# EAGLE design H10R4 (EAGLE 9.6.1)

## Sheet 1 of 2
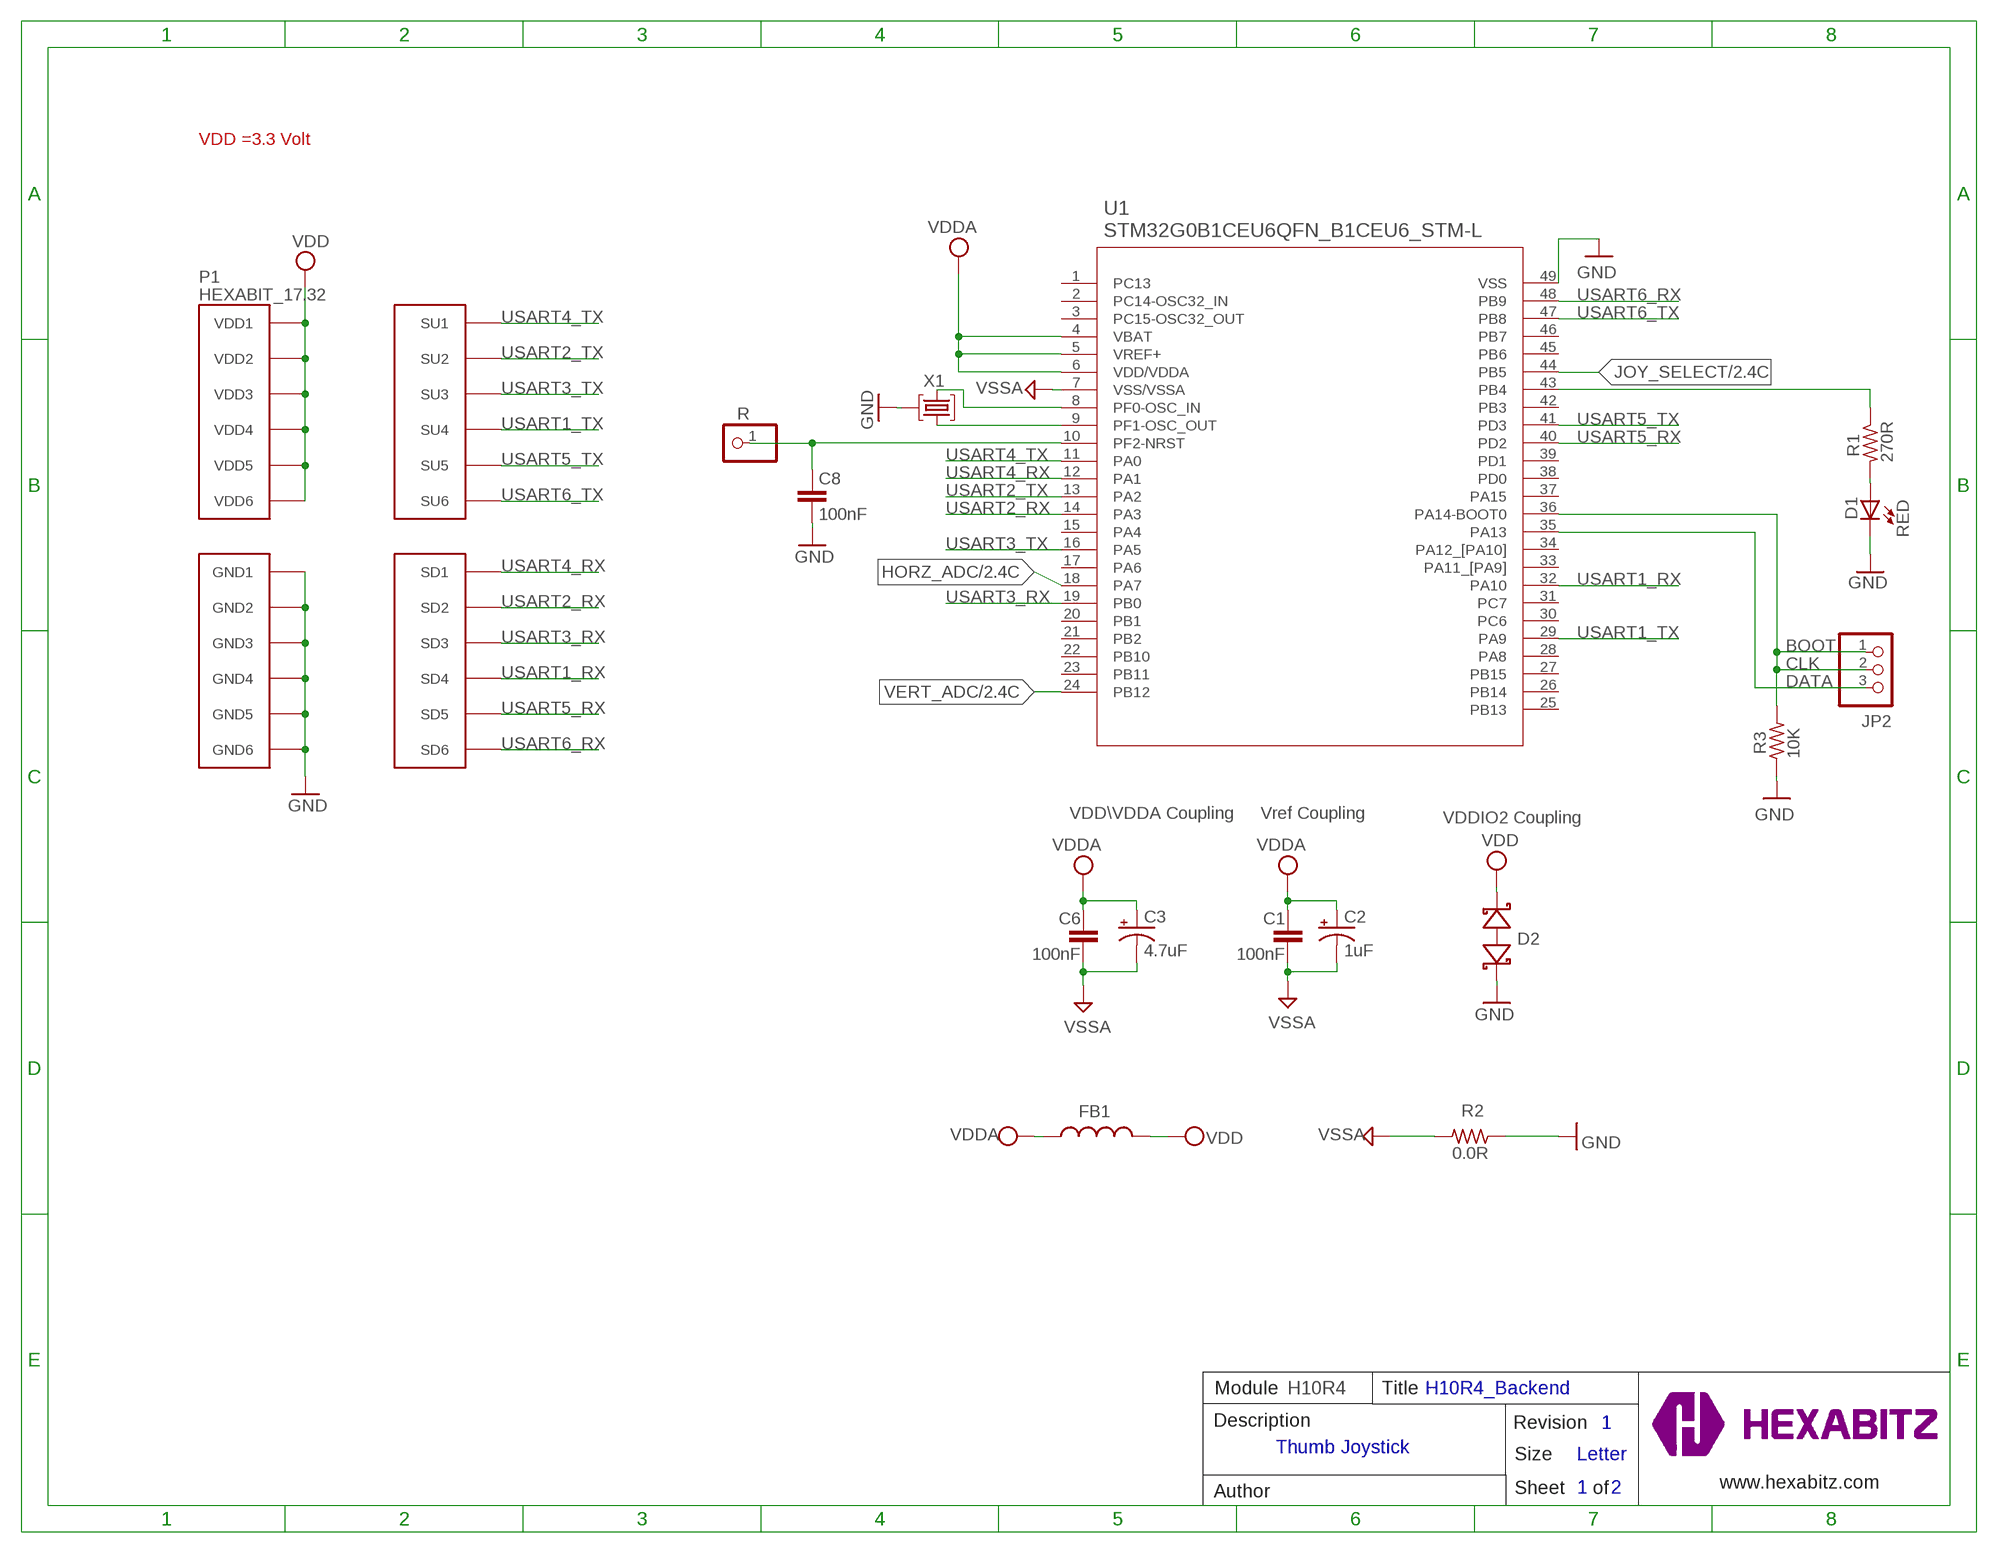
[diagram p0: schematic, sheet 1]

### Parts
C1  100nF  C-0603  [C-0603]
C2  1uF  C-0805-POL  [C-0805-POL]
C3  4.7uF  C-0805-POL  [C-0805-POL]
C6  100nF  C-0603  [C-0603]
C8  100nF  C-0603  [C-0603]
D1  RED  VLMS1300-GS08  [VLMS1300-GS08]
D2  BOURNS_CDSOD323-T03SCBOURNS_CDSOD323-T03SC_0_0  [BOURNS_CDSOD323-T03SC_0]
FB1  FB-TDK_MMZ1608Y300B  [FB-TDK_MMZ1608Y300B]
JP2  PINHD-1X3  [1X03]
P1  HEXABIT_17.32  [HEXABIT_17.32]
R  R  PINHD-1X1  [1X01]
R1  270R  R-0603  [R-0603]
R2  0.0R  R-0603  [R-0603]
R3  10K  R-0603  [R-0603]
TRIMBLE-LOGO1  HEXA-LOGO  [HEXA-LOGO]
U1  STM32G0B1CEU6QFN_B1CEU6_STM-L  [QFN_B1CEU6_STM-L]
X1  XTALL_CSTCE8M00G52  [XTALL_CSTCE8M00G52]

### Nets
CLK: JP2.1 JP2.2 R3.2 U1.36(PA14-BOOT0)
DATA: JP2.3 U1.35(PA13)
GND: C8.2 D1.C D2.1(A) P1.PAD_PD7(GND1) P1.PAD_PD8(GND2) P1.PAD_PD9(GND3) P1.PAD_PD10(GND4) P1.PAD_PD11(GND5) P1.PAD_PD12(GND6) R2.1 R3.1 U1.49(VSS) X1.P$2 ; also sheet 2
HORZ_ADC: U1.18(PA7) ; also sheet 2
JOY_SELECT: U1.44(PB5) ; also sheet 2
N$1: R1.1 U1.43(PB4)
N$3: D1.A R1.2
N$4: C8.1 R.1 U1.10(PF2-NRST)
N$5: U1.9(PF1-OSC_OUT) X1.P$1
N$6: U1.8(PF0-OSC_IN) X1.P$3
USART1_RX: P1.PAD_PD4(SD4) U1.32(PA10)
USART1_TX: P1.PAD_PU4(SU4) U1.29(PA9)
USART2_RX: P1.PAD_PD2(SD2) U1.14(PA3)
USART2_TX: P1.PAD_PU2(SU2) U1.13(PA2)
USART3_RX: P1.PAD_PD3(SD3) U1.19(PB0)
USART3_TX: P1.PAD_PU3(SU3) U1.16(PA5)
USART4_RX: P1.PAD_PD1(SD1) U1.12(PA1)
USART4_TX: P1.PAD_PU1(SU1) U1.11(PA0)
USART5_RX: P1.PAD_PD5(SD5) U1.40(PD2)
USART5_TX: P1.PAD_PU5(SU5) U1.41(PD3)
USART6_RX: P1.PAD_PD6(SD6) U1.48(PB9)
USART6_TX: P1.PAD_PU6(SU6) U1.47(PB8)
VDD: D2.2(C) FB1.2 P1.PAD_PU7(VDD1) P1.PAD_PU8(VDD2) P1.PAD_PU9(VDD3) P1.PAD_PU10(VDD4) P1.PAD_PU11(VDD5) P1.PAD_PU12(VDD6) ; also sheet 2
VDDA: C1.1 C2.1(+) C3.1(+) C6.1 FB1.1 U1.4(VBAT) U1.5(VREF+) U1.6(VDD/VDDA)
VERT_ADC: U1.24(PB12) ; also sheet 2
VSSA: C1.2 C2.2(-) C3.2(-) C6.2 R2.2 U1.7(VSS/VSSA)
Unconnected: U1.1(PC13) U1.2(PC14-OSC32_IN) U1.3(PC15-OSC32_OUT) U1.15(PA4) U1.17(PA6) U1.20(PB1) U1.21(PB2) U1.22(PB10) U1.23(PB11) U1.25(PB13) U1.26(PB14) U1.27(PB15) U1.28(PA8) U1.30(PC6) U1.31(PC7) U1.33(PA11_[PA9]) U1.34(PA12_[PA10]) U1.37(PA15) U1.38(PD0) U1.39(PD1) U1.42(PB3) U1.45(PB6) U1.46(PB7)

### Notes on the sheet
- VDD =3.3 Volt
- BOOT
- VDD\VDDA Coupling | Vref Coupling | VDDIO2 Coupling
- Module | H10R4 | Title | H10R4_Backend
- Description | Revision | 1
- Thumb Joystick
- Size | Letter
- 1 | 2 | www.hexabitz.com
- Author | Sheet     of
- C:/Users/Admin/Desktop/logodraft.bmp

## Sheet 2 of 2
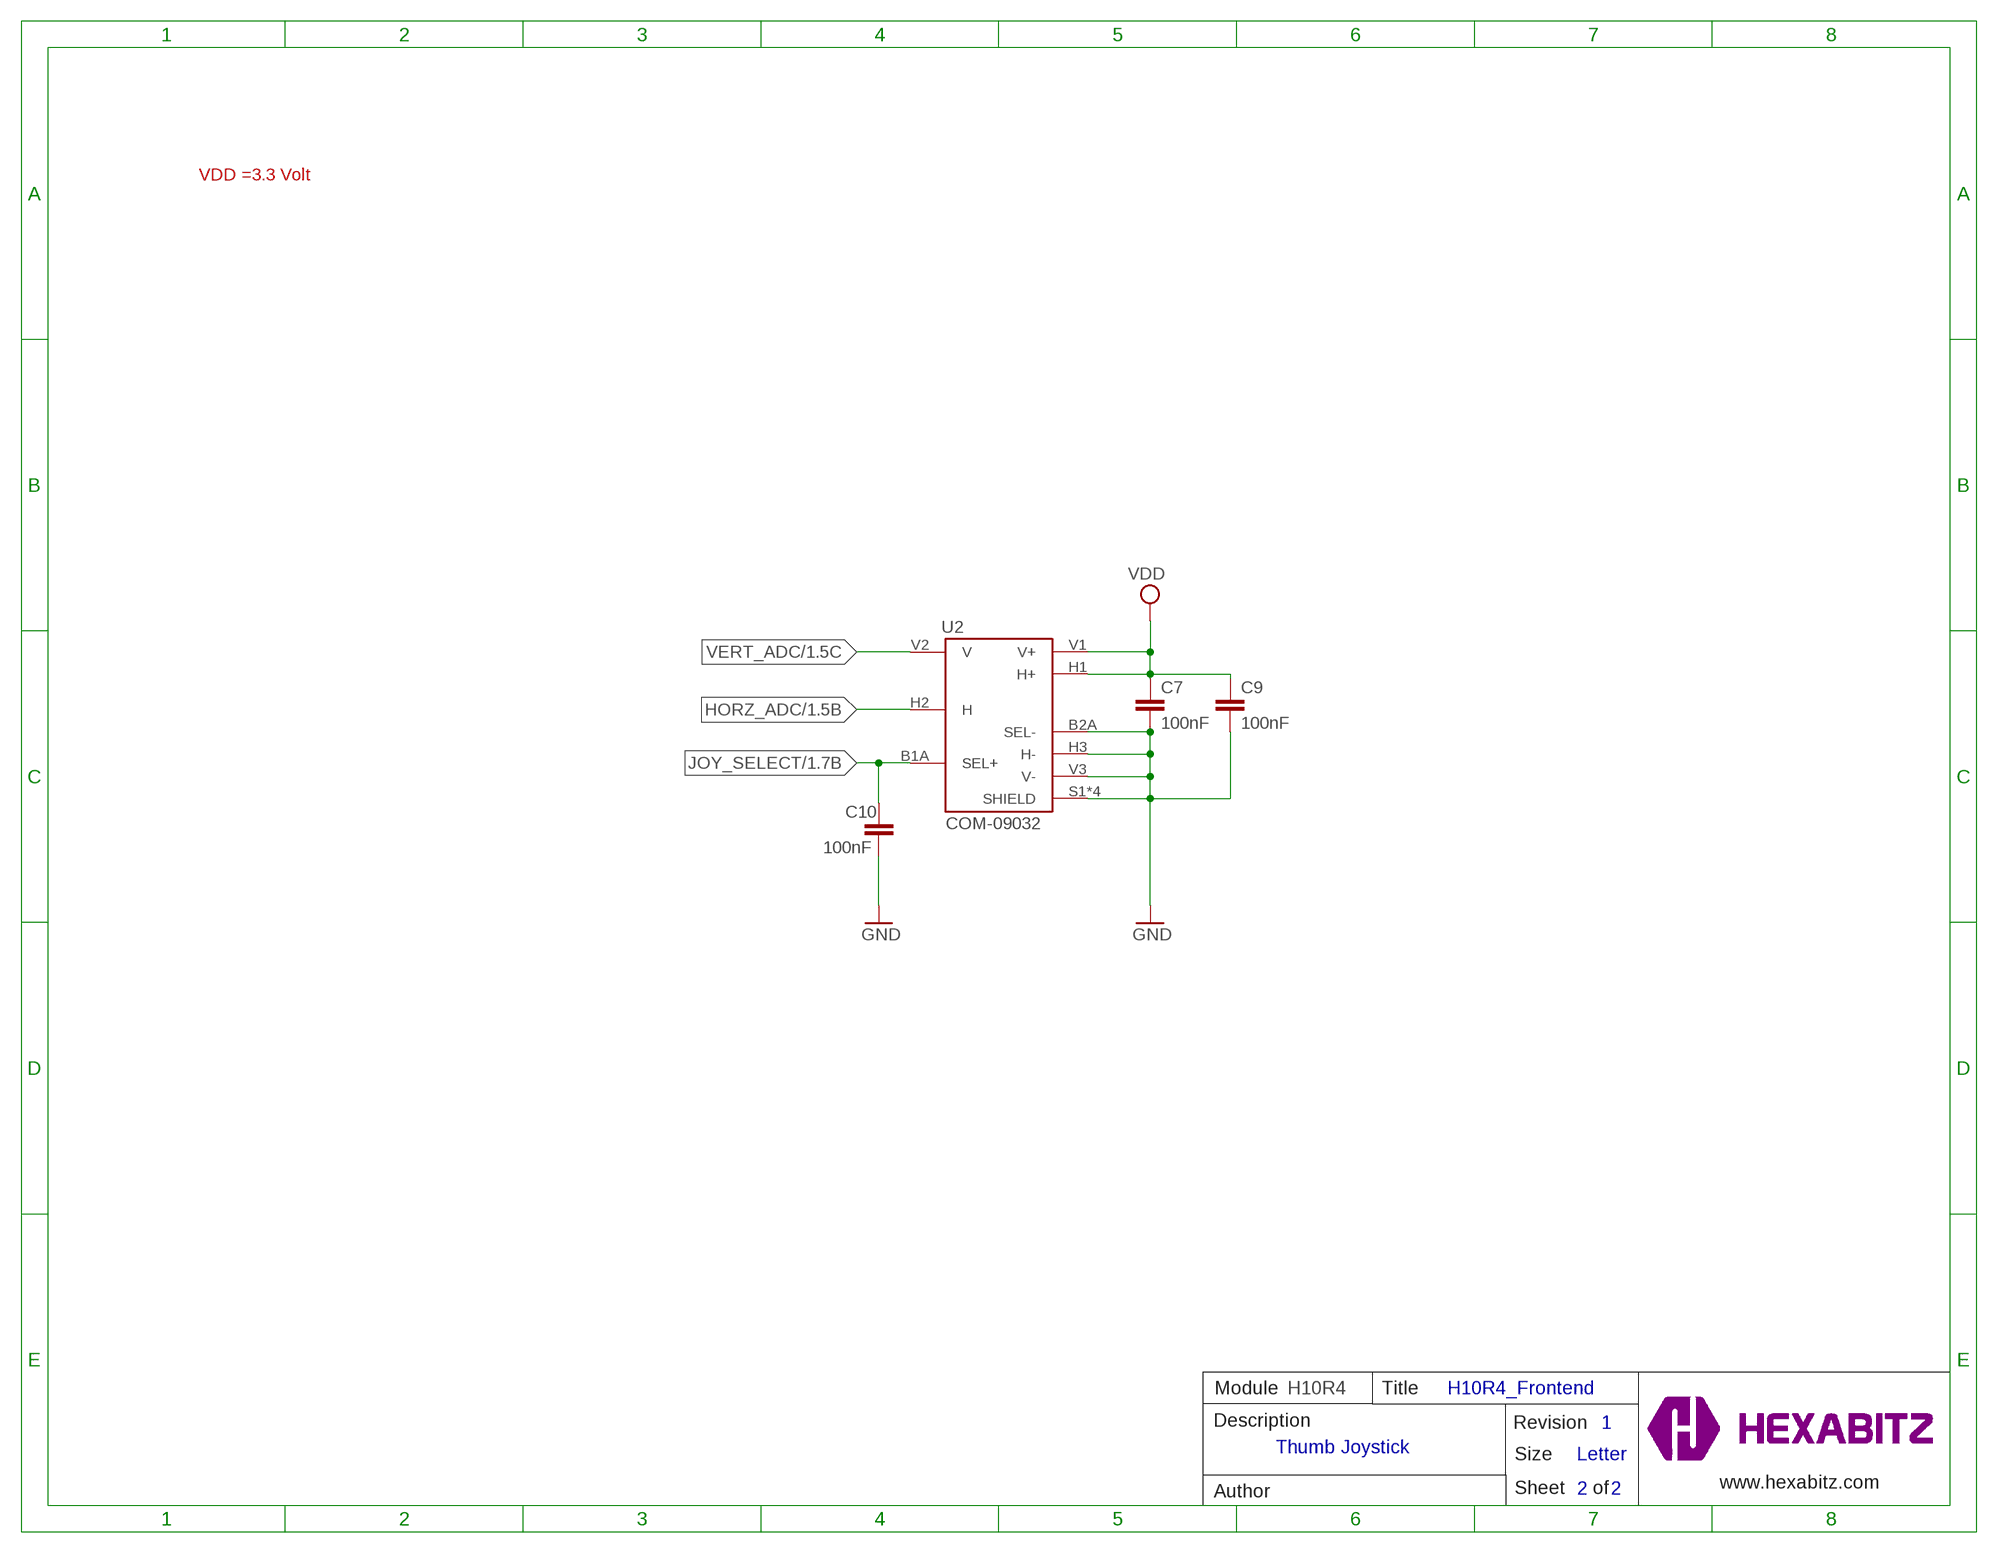
[diagram p1: schematic, sheet 2]

### Parts
C7  100nF  C-0603  [C-0603]
C9  100nF  C-0603  [C-0603]
C10  100nF  C-0603  [C-0603]
U2  COM-09032  [XDCR_COM-09032]

### Nets
GND: C7.2 C9.2 C10.2 U2.B2A(SEL-) U2.H3(H-) U2.S1(SHIELD) U2.S2(SHIELD) U2.S3(SHIELD) U2.S4(SHIELD) U2.V3(V-) ; also sheet 1
HORZ_ADC: U2.H2(H) ; also sheet 1
JOY_SELECT: C10.1 U2.B1A(SEL+) ; also sheet 1
VDD: C7.1 C9.1 U2.H1(H+) U2.V1(V+) ; also sheet 1
VERT_ADC: U2.V2(V) ; also sheet 1

### Notes on the sheet
- VDD =3.3 Volt
- Module | H10R4 | Title | H10R4_Frontend
- Description | Revision | 1
- Thumb Joystick
- Size | Letter
- www.hexabitz.com
- Author | Sheet     of | 2 | 2
- C:/Users/Admin/Desktop/logodraft.bmp

## Library data of the parts
C1 C6 C8 C9 = HEXABITZ_RCLS:C-0603: CAP CER 10% X7R 0603
C2 C3 = HEXABITZ_RCLS:C-0805-POL: Cap Tant Solid SMD 2012
C7 C10 = HEXABITZ_RCLS:C-0603: CAP CER 10% X7R 0603; CAPACITANCE: 100nF; MFN: KEMET; MPN: C0603C104K8RACTU; OCTOPART_URL: https://octopart.com/c0603c104k8ractu-kemet-145075?r=sp&s=9bS9ASSwSEqMCE9KBEQZ0g; TOLERANCE: 10%; VOLTAGE_RATING: 10V
D1 = Hexabitz:VLMS1300-GS08: Red 0603 130° Clear 54 mcd 2 V Surface Mount ChipLED ; Octopart Url : http://octopart.com/vlms1300-gs08-vishay-21709201; MFN: Vishay; MPN: VLMS1300-GS08; OCTOPART_URL: https://octopart.com/vlms1300-gs08-vishay-21709201?r=sp&s=_gcP4_q8T1SC6PJQPTQ9yA
D2 = HEXABITZ_RCLS:BOURNS_CDSOD323-T03SC: CDSOD323-TxxSC - TVS Diode Series; DESCRIPTION: Dio Tvs Vwm 03V 500W Bidir Sod323 / Tape & Reel - 7" Reel; MFN: Bourns; MPN: CDSOD323-T03SC; OCTOPART_URL: https://octopart.com/cdsod323-t03sc-bourns-10487153?r=sp
FB1 = HEXABITZ_RCLS:FB-TDK_MMZ1608Y300B: Ferrite Beads Multi-Layer 30Ohm 25% 100MHz 1.5A 50mOhm DCR 0603; MFN: TDK; MPN: MMZ1608Y300B; OCTOPART_URL: https://octopart.com/mmz1608y300b-tdk-368280?r=sp&s=cd9_2ZEqQ9q9UNBuQgHAiA
JP2 = HEXABITZ_CONNECTION_PARTS:PINHD-1X3: PIN HEADER
P1 = hexabitz_connectors:HEXABIT_?: Hexabitz Hexagon Module Connector Hexagon side length = 28.87mm.
R = HEXABITZ_USER_INTERFACE_PARTS:PINHD-1X1: PIN HEADER; MFN: TE Connectivity; MPN: 87227-1; OCTOPART_URL: https://octopart.com/87227-1-te+connectivity-39512052?r=sp
R1 R3 = HEXABITZ_RCLS:R-0603: Thick Film Resistors - SMD 0603
R2 = HEXABITZ_RCLS:R-0603: Thick Film Resistors - SMD 0603; MFN: Yageo; MPN: RC0603JR-070RL; OCTOPART_URL: https://octopart.com/rc0603jr-070rl-yageo-1241539?r=sp&s=X2NteqRjRNWrnx42Y0aliA; RESISTANCE: 0.0 Ohm
TRIMBLE-LOGO1 = HEXABITZ_USER_INTERFACE_PARTS:HEXA-LOGO: Trimble-Logo
U1 = HEXABITZ_ICs:STM32G0B1CEU6; COPYRIGHT: Copyright (C) 2021 Ultra Librarian. All rights reserved.; MANUFACTURER_PART_NUMBER: STM32G0B1CEU6; MFR_NAME: STMicroelectronics
U2 = HEXABITZ_ICs:COM-09032: Thumb Joystick Check availability <https://pricing.snapeda.com/parts/COM-09032/SparkFun%20Electronics/view-part?ref=eda>; AVAILABILITY: In Stock; CHECK_PRICES: https://www.snapeda.com/parts/COM-09032/SparkFun/view-part/?ref=eda; DESCRIPTION: Joystick, 2 - Axis Analog (Resistive) Output; MF: SparkFun Electronics; MP: COM-09032; PACKAGE: Package; PRICE: None; SNAPEDA_LINK: https://www.snapeda.com/parts/COM-09032/SparkFun/view-part/?ref=snap
X1 = Hexabitz:XTALL_CSTCE8M00G52: MURATA CSTCE8M00G52-R0 RESONATOR, SMD, 8MHZ ; Octopart Url : https://octopart.com/cstce8m00g52-r0-murata-7145559; MFN: Murata; MPN: CSTCE8M00G52Z-R0; OCTOPART_URL: https://octopart.com/cstce8m00g52z-r0-murata-17755941?r=sp&s=JDnNJnrHQhyS8Zk4ofFWXw

## Board
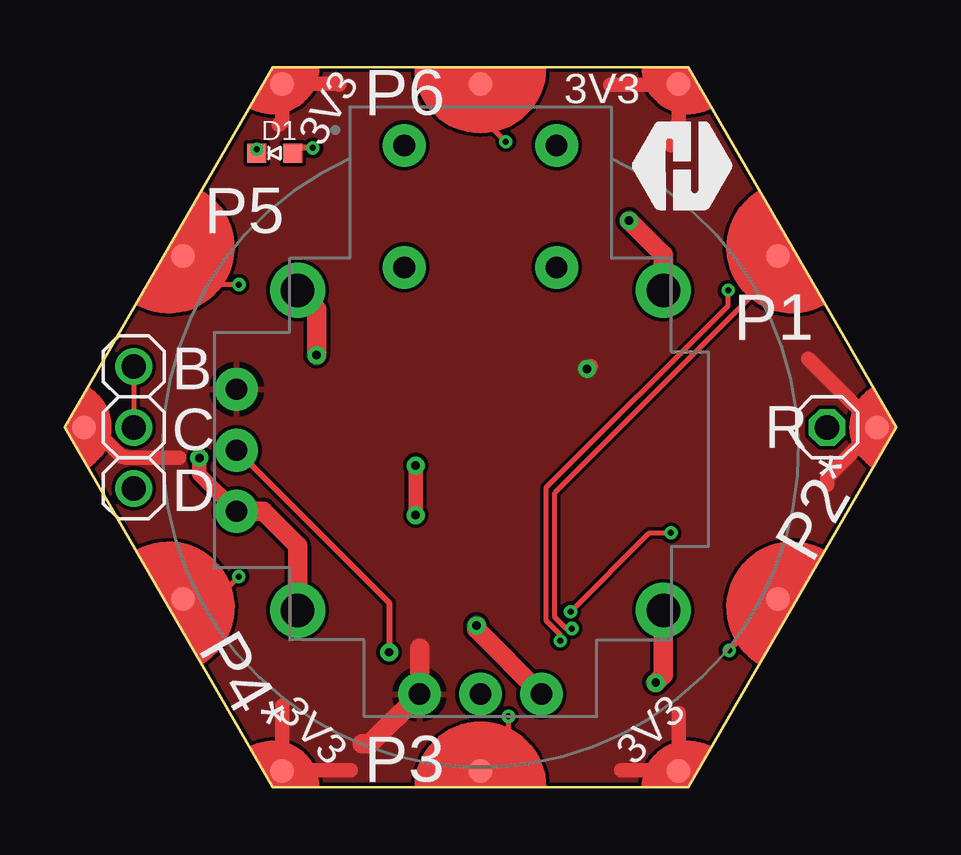
[diagram p2: board, top side]
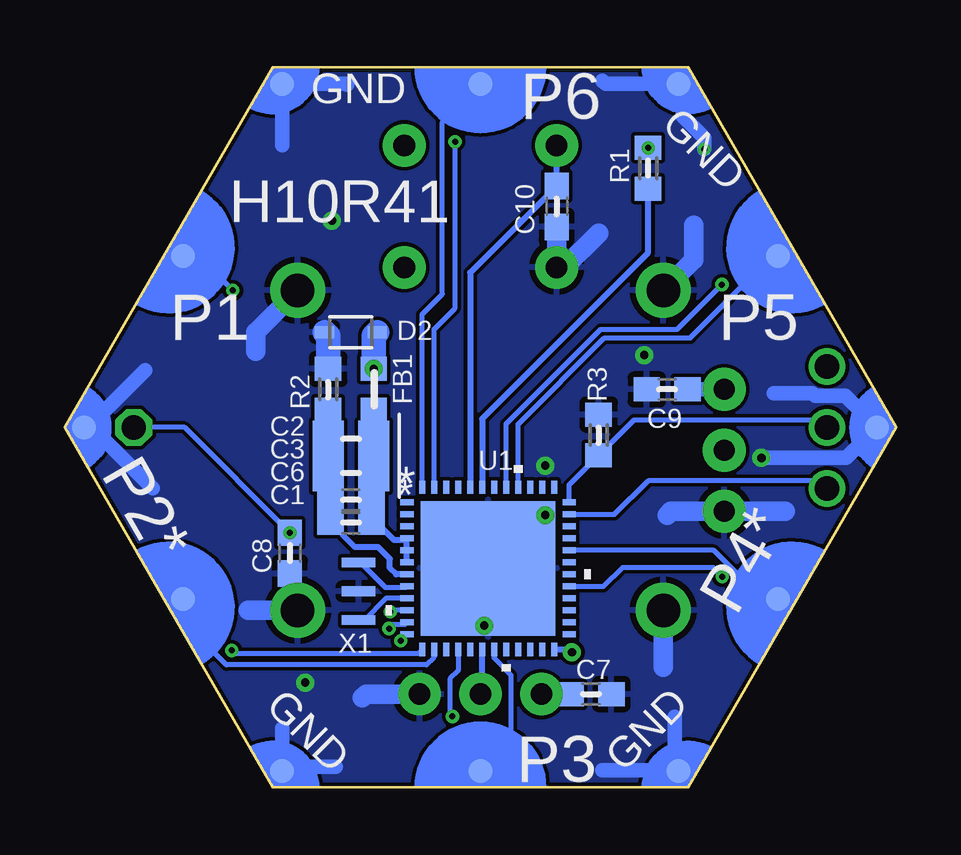
[diagram p3: board, bottom side, seen from below]

Size 34.64 x 30 mm. Coordinates in mm from the lower left corner, seen from the top.
Copper layers (1*16): Top 0.035mm / dielectric 1.5mm / Bottom 0.035mm
Design rules "default *": minimum track width 6mil, minimum drill 0.25mm, track to track 6mil, track to pad 6mil, pad to pad 6mil, via to via 6mil, smd to smd 0mil, copper to edge 0.15mm, drill to drill 6mil, minimum pad ring 10mil, minimum via ring 4mil, stop-mask expansion 4mil, vias tented up to drill 25mil, thermal gap 10mil

### Footprints (pad centres in the part's own frame; a part is rotated, then mirrored left to right if it is on the bottom)
C-0603 = smd 1.1 x 1: 1 -0.85,0; 2 0.85,0
C-0805-POL = smd 1.3 x 1.5: 1 -0.95,0; 2 0.95,0
VLMS1300-GS08 = smd 0.8 x 0.8: A 0,0.75; C 0,-0.75
BOURNS_CDSOD323-T03SC_0 = smd 0.8 x 0.5: 1 -1.1,0; 2 1.1,0
FB-TDK_MMZ1608Y300B = smd 1 x 1.1: 1 -0.85,0; 2 0.85,0
1X03 = drill 1.016: 1 -2.54,0; 2 0,0; 3 2.54,0
HEXABIT_17.32 = smd 1 x 1 bottom: PAD_PD1 12.39,7.15; PAD_PD2 12.39,-7.15; PAD_PD3 0,-14.31; PAD_PD4 -12.39,-7.15; PAD_PD5 -12.39,7.15; PAD_PD6 0,14.31; PAD_PD7 8.26,14.31; PAD_PD8 16.52,0; PAD_PD9 8.26,-14.31; PAD_PD10 -8.26,-14.31; PAD_PD11 -16.52,0; PAD_PD12 -8.26,14.31 | smd 1 x 1: PAD_PU1 12.39,7.15; PAD_PU2 12.39,-7.15; PAD_PU3 0,-14.31; PAD_PU4 -12.39,-7.15; PAD_PU5 -12.39,7.15; PAD_PU6 0,14.31; PAD_PU7 8.26,14.31; PAD_PU8 16.52,0; PAD_PU9 8.26,-14.31; PAD_PU10 -8.26,-14.31; PAD_PU11 -16.52,0; PAD_PU12 -8.26,14.31
1X01 = drill 1.016 octagon: 1 0,0
R-0603 = smd 1 x 1.1: 1 -0.85,0; 2 0.85,0
QFN_B1CEU6_STM-L = smd 0.55 x 0.254: 1 -3.38,2.751; 2 -3.38,2.251; 3 -3.38,1.75; 4 -3.38,1.25; 5 -3.38,0.75; 6 -3.38,0.25; 7 -3.38,-0.25; 8 -3.38,-0.75; 9 -3.38,-1.25; 10 -3.38,-1.75; 11 -3.38,-2.251; 12 -3.38,-2.751; 25 3.38,-2.751; 26 3.38,-2.251; 27 3.38,-1.75; 28 3.38,-1.25; 29 3.38,-0.75; 30 3.38,-0.25; 31 3.38,0.25; 32 3.38,0.75; 33 3.38,1.25; 34 3.38,1.75; 35 3.38,2.251; 36 3.38,2.751 | smd 0.254 x 0.55: 13 -2.751,-3.38; 14 -2.251,-3.38; 15 -1.75,-3.38; 16 -1.25,-3.38; 17 -0.75,-3.38; 18 -0.25,-3.38; 19 0.25,-3.38; 20 0.75,-3.38; 21 1.25,-3.38; 22 1.75,-3.38; 23 2.251,-3.38; 24 2.751,-3.38; 37 2.751,3.38; 38 2.251,3.38; 39 1.75,3.38; 40 1.25,3.38; 41 0.75,3.38; 42 0.25,3.38; 43 -0.25,3.38; 44 -0.75,3.38; 45 -1.25,3.38; 46 -1.75,3.38; 47 -2.251,3.38; 48 -2.751,3.38 | smd 5.6 x 5.6: 49 0,0
XDCR_COM-09032 = drill 0.9 pad 1.778: B1A -3.175,12.7; B1B 3.175,12.7; B2A -3.175,7.62; B2B 3.175,7.62 | drill 0.889 pad 1.778: H1 -2.54,-10.16; H2 0,-10.16; H3 2.54,-10.16; V1 -10.16,2.54; V2 -10.16,0; V3 -10.16,-2.54 | drill 1.397 pad 2.286: S1 -7.62,6.668; S2 -7.62,-6.668; S3 7.62,-6.668; S4 7.62,6.668
XTALL_CSTCE8M00G52 = smd 1.4 x 0.4: P$1 0,1.2; P$2 0,0; P$3 0,-1.2

### Placement (x,y rotation side)
C1  22.72,11.98 180 bottom
C2  22.72,13.1 180 bottom
C3  22.72,14.52 180 bottom
C6  22.72,11.03 180 bottom
C7  12.72,3.89 0 bottom
C8  25.26,9.76 270 bottom
C9  9.54,16.59 180 bottom
C10  14.14,24.21 270 bottom
D1  8.75,26.43 270 top
D2  22.72,18.97 0 bottom
FB1  21.77,16.59 90 bottom
JP2  2.87,15 270 top
P1  17.32,15 0 top
R  31.77,15 0 top
R1  10.34,25.8 90 bottom
R2  23.67,16.59 270 bottom
R3  12.4,14.68 270 bottom
TRIMBLE-LOGO1  25.73,24.05 0 top
U1  17,9.13 0 bottom
U2  17.32,14.05 0 top
X1  22.4,8.17 180 bottom

### Tracks (layer width: path | path; a pad name or v marks a point on that pad's centre or on a via)
CLK
  Top 0.203: JP2.1 JP2.2
  Bottom 0.203: U1.36 13.62,12.61 R3.2 10.91,15.32 3.19,15.32 JP2.2
DATA
  Bottom 0.203: JP2.3 3.19,12.78 10.34,12.78 11.74,11.38 U1.35
GND  (via drill 0.25 pad 0.55, 0.35 pad 0.75)
  Top 0.152: D1.C v8,26.59
  Top 0.61: v5.61,13.73 5.61,13.06 U2.V3 | v14.62,11.35 v14.62,13.41
  Top 0.813: U2.V3 8.27,11.51 9.7,10.08 U2.S2 | U2.S3 24.94,4.68 v24.62,4.36 | U2.S4 24.94,22.19 v23.51,23.62 | U2.H3 17.16,6.59 v17.16,6.75 | U2.S1 10.49,19.92 v10.49,18.02
  Bottom 0.61: 25.58,2.46 P1.PAD_PD9 25.4,0.87 23.35,0.87 | 12.24,0.71 9.08,0.71 P1.PAD_PD10 9.22,0.85 9.22,2.93 | v5.61,13.73 2.07,13.73 P1.PAD_PD11 2.12,16.32 3.38,16.32 3.49,16.43 5.1,16.43 | 31.29,17.38 33.67,15 P1.PAD_PD8 33.51,15 30.97,12.46 | v8,26.59 8,27.07 8.9,27.97 8.9,29.15 P1.PAD_PD12 12.1,29.31 12.24,29.45 | U1.49 14.78,11.35 v14.62,11.35 | 25.58,26.75 P1.PAD_PD7 22.9,29.31 22.88,29.29
  Bottom 0.813: U2.S3 26.99,7.38 | U2.S2 9.7,5 | 9.54,11.35 9.38,11.51 U2.V3 4.62,11.51 | U2.H3 22.08,3.89 22.24,3.73 | U2.S1 8.43,21.98 8.43,23.41 | C10.2 U2.B2A 13.83,21.67 12.4,23.1 | U2.S4 26.69,18.97 26.69,18.18 | U1.49 17.16,8.97 v17.16,6.75
  Bottom 1.016: D2.1 23.67,18.82 R2.1
  pour Bottom: 5.1,30.08 28.27,30.08 34.78,23.57 34.78,7.54 27.16,-0.08 7,-0.08 -0.14,7.06 -0.14,24.84
HORZ_ADC
  Bottom 0.254: U2.H2 17.25,3.95 U1.18
JOY_SELECT
  Bottom 0.254: U1.44 17.75,21.45 C10.1 U2.B1A
N$1
  Bottom 0.254: R1.1 10.34,22.28 17.25,15.36 U1.43
N$3  (via drill 0.25 pad 0.55)
  Top 0.203: 9.71,26.64 D1.A
  Top 0.254: R1.2 9.71,26.64
  other vias: 10.34,26.64
N$4  (via drill 0.25 pad 0.55)
  Top 0.203: v21.07,7.32 24.36,10.61 C8.1
  Bottom 0.203: U1.10 21.02,7.38 v21.07,7.32 | C8.1 29.65,15 R.1
  other vias: 25.26,10.61
N$5
  Bottom 0.203: U1.9 21.27,7.88 22.17,6.97 X1.P$1
N$6
  Bottom 0.203: X1.P$3 22.33,9.37 21.29,8.33 20.43,8.33 U1.8
USART1_RX
  Bottom 0.203: P1.PAD_PD4 5.57,7.85 7.59,9.88 U1.32
USART1_TX  (via drill 0.25 pad 0.55)
  Top 0.203: v7.25,8.79 6.31,7.85 P1.PAD_PU4
  Bottom 0.203: U1.29 12.19,8.38 11.4,9.17 7.63,9.17 v7.25,8.79
USART2_RX
  Bottom 0.203: U1.14 19.25,5.43 19.57,5.11 27.91,5.11 29.5,6.7 29.71,7.06 P1.PAD_PD2
USART2_TX  (via drill 0.25 pad 0.55)
  Top 0.203: v27.68,5.71 29.71,7.73 P1.PAD_PU2
  Bottom 0.203: v27.68,5.71 27.56,5.59 19.91,5.59 U1.13
USART3_RX
  Bottom 0.203: U1.19 16.75,5.38 16.05,4.68 16.05,1.96 P1.PAD_PD3
USART3_TX  (via drill 0.25 pad 0.55)
  Top 0.203: v18.49,2.96 18.49,1.86 P1.PAD_PU3
  Bottom 0.203: U1.16 18.25,4.86 18.59,4.52 18.59,3.06 v18.49,2.96
USART4_RX  (via drill 0.25 pad 0.55)
  Top 0.203: v20.64,6.12 20.64,6.36 20.07,6.93 20.07,12.51 27.64,20.08 v27.64,20.71
  Bottom 0.203: U1.12 v20.64,6.12 | v20.64,6.12 | v27.64,20.71 29.07,22.15 P1.PAD_PD1
USART4_TX  (via drill 0.25 pad 0.55)
  Top 0.203: v21.13,6.62 20.89,6.62 20.42,7.08 20.42,12.28 29.71,21.56 P1.PAD_PU1
  Bottom 0.203: U1.11 20.46,6.79 20.96,6.79 v21.13,6.62
USART5_RX
  Bottom 0.203: U1.40 15.75,15.14 12.16,18.73 8.57,18.73 5.16,22.15 P1.PAD_PD5
USART5_TX  (via drill 0.25 pad 0.55)
  Top 0.203: v7.26,20.95 6.13,20.95 P1.PAD_PU5
  Bottom 0.203: v7.26,20.95 9.12,19.09 12.31,19.09 16.25,15.15 U1.41
USART6_RX
  Bottom 0.203: U1.48 19.75,19.71 18.91,20.56 18.91,27.72 P1.PAD_PD6
USART6_TX  (via drill 0.25 pad 0.55)
  Top 0.203: v18.38,26.91 17.32,27.96 P1.PAD_PU6
  Bottom 0.203: U1.47 19.25,19.1 18.38,19.97 v18.38,26.91
VDD  (via drill 0.35 pad 0.75)
  Top 0.61: P1.PAD_PU11 1.15,15 2.37,13.78 2.51,13.78 2.56,13.73 4.78,13.73 | 9.06,3.41 P1.PAD_PU10 9.08,0.71 11.92,0.71 | 25.26,26.75 25.58,27.07 P1.PAD_PU7 25.56,29.29 22.72,29.29 | 11.45,29.29 11.42,29.31 P1.PAD_PU12 9.06,27.76 8.91,27.6 | 31.77,12.62 31.77,12.93 P1.PAD_PU8 30.98,17.86 30.97,17.86 | 25.58,3.09 P1.PAD_PU9 25.56,0.71 23.19,0.71 | FB1.2 21.87,17.54 21.92,17.54
  Top 0.813: 12.4,1.82 12.72,1.82 U2.H1 14.78,5.79
  Bottom 0.61: C9.1 U2.V1
  Bottom 0.813: C7.1 U2.H1
  Bottom 1.016: FB1.2 21.77,18.82 D2.2
  other vias: 21.77,17.44
  pour Top: 5.1,30.08 28.27,30.08 34.78,23.57 34.78,7.54 27.16,-0.08 7,-0.08 -0.14,7.06 -0.14,24.84
VDDA
  Bottom 0.254: U1.6 U1.5 U1.4 20.45,10.31 20.93,10.31 21.65,11.03 C6.1 C1.1 21.87,13 C2.1 21.92,13.25 21.92,14.37 C3.1 FB1.1
VERT_ADC  (via drill 0.35 pad 0.75)
  Top 0.254: U2.V2 13.51,7.7 v13.51,5.63
  Bottom 0.254: v13.51,5.63 13.62,5.75 U1.24
VSSA
  Bottom 0.254: 23.51,15.58 23.62,15.69 | 23.62,15.69 R2.2 | 23.62,15.69 23.67,15.64 C3.2 C2.2 23.57,13 C1.2 C6.2 22.55,10.01 21.58,10.01 21.1,9.52 21.1,9.13 20.84,8.88 U1.7

### Text on the board
tPlace: P6 | 3V3 | 3V3 | P5 | P1 | P2* | P4* | 3V3 | 3V3 | P3
bPlace: P6 | GND | GND | H10R41 | P5 | P1 | * | P2* | P4* | GND | GND | P3
tNames: B | C | D